# Altium project DM3370.PrjPcb (part 11 of 14)

## Sheet DM3370_USB.SchDoc: =project_title
size Tabloid; PageSetup: Record=PageOptions|CenterHorizontal=True|CenterVertical=True|PrintScale=0.73|XCorrection=1.00|YCorrection=1.00|PrintKind=0|BorderSize=5000000|LeftOffset=0|BottomOffset=0|Orientation=2|PaperLength=1000|PaperWidth=1000|Scale=100|PaperSource=7|PrintQuality=-4|MediaType=1|DitherType=10|PaperKind=A4|PrintScaleMode=1; CompanyName: Luxonis Holding; DrawnBy: David Malovrh; Organization: Luxonis Holding; Address1: 1925 Harmony Park Drive; Address2: Westminster, CO; Address3: 80234; Address4: United States; DocumentNumber: 7; Revision: R5M2E5; SheetNumber: 7; SheetTotal: 17
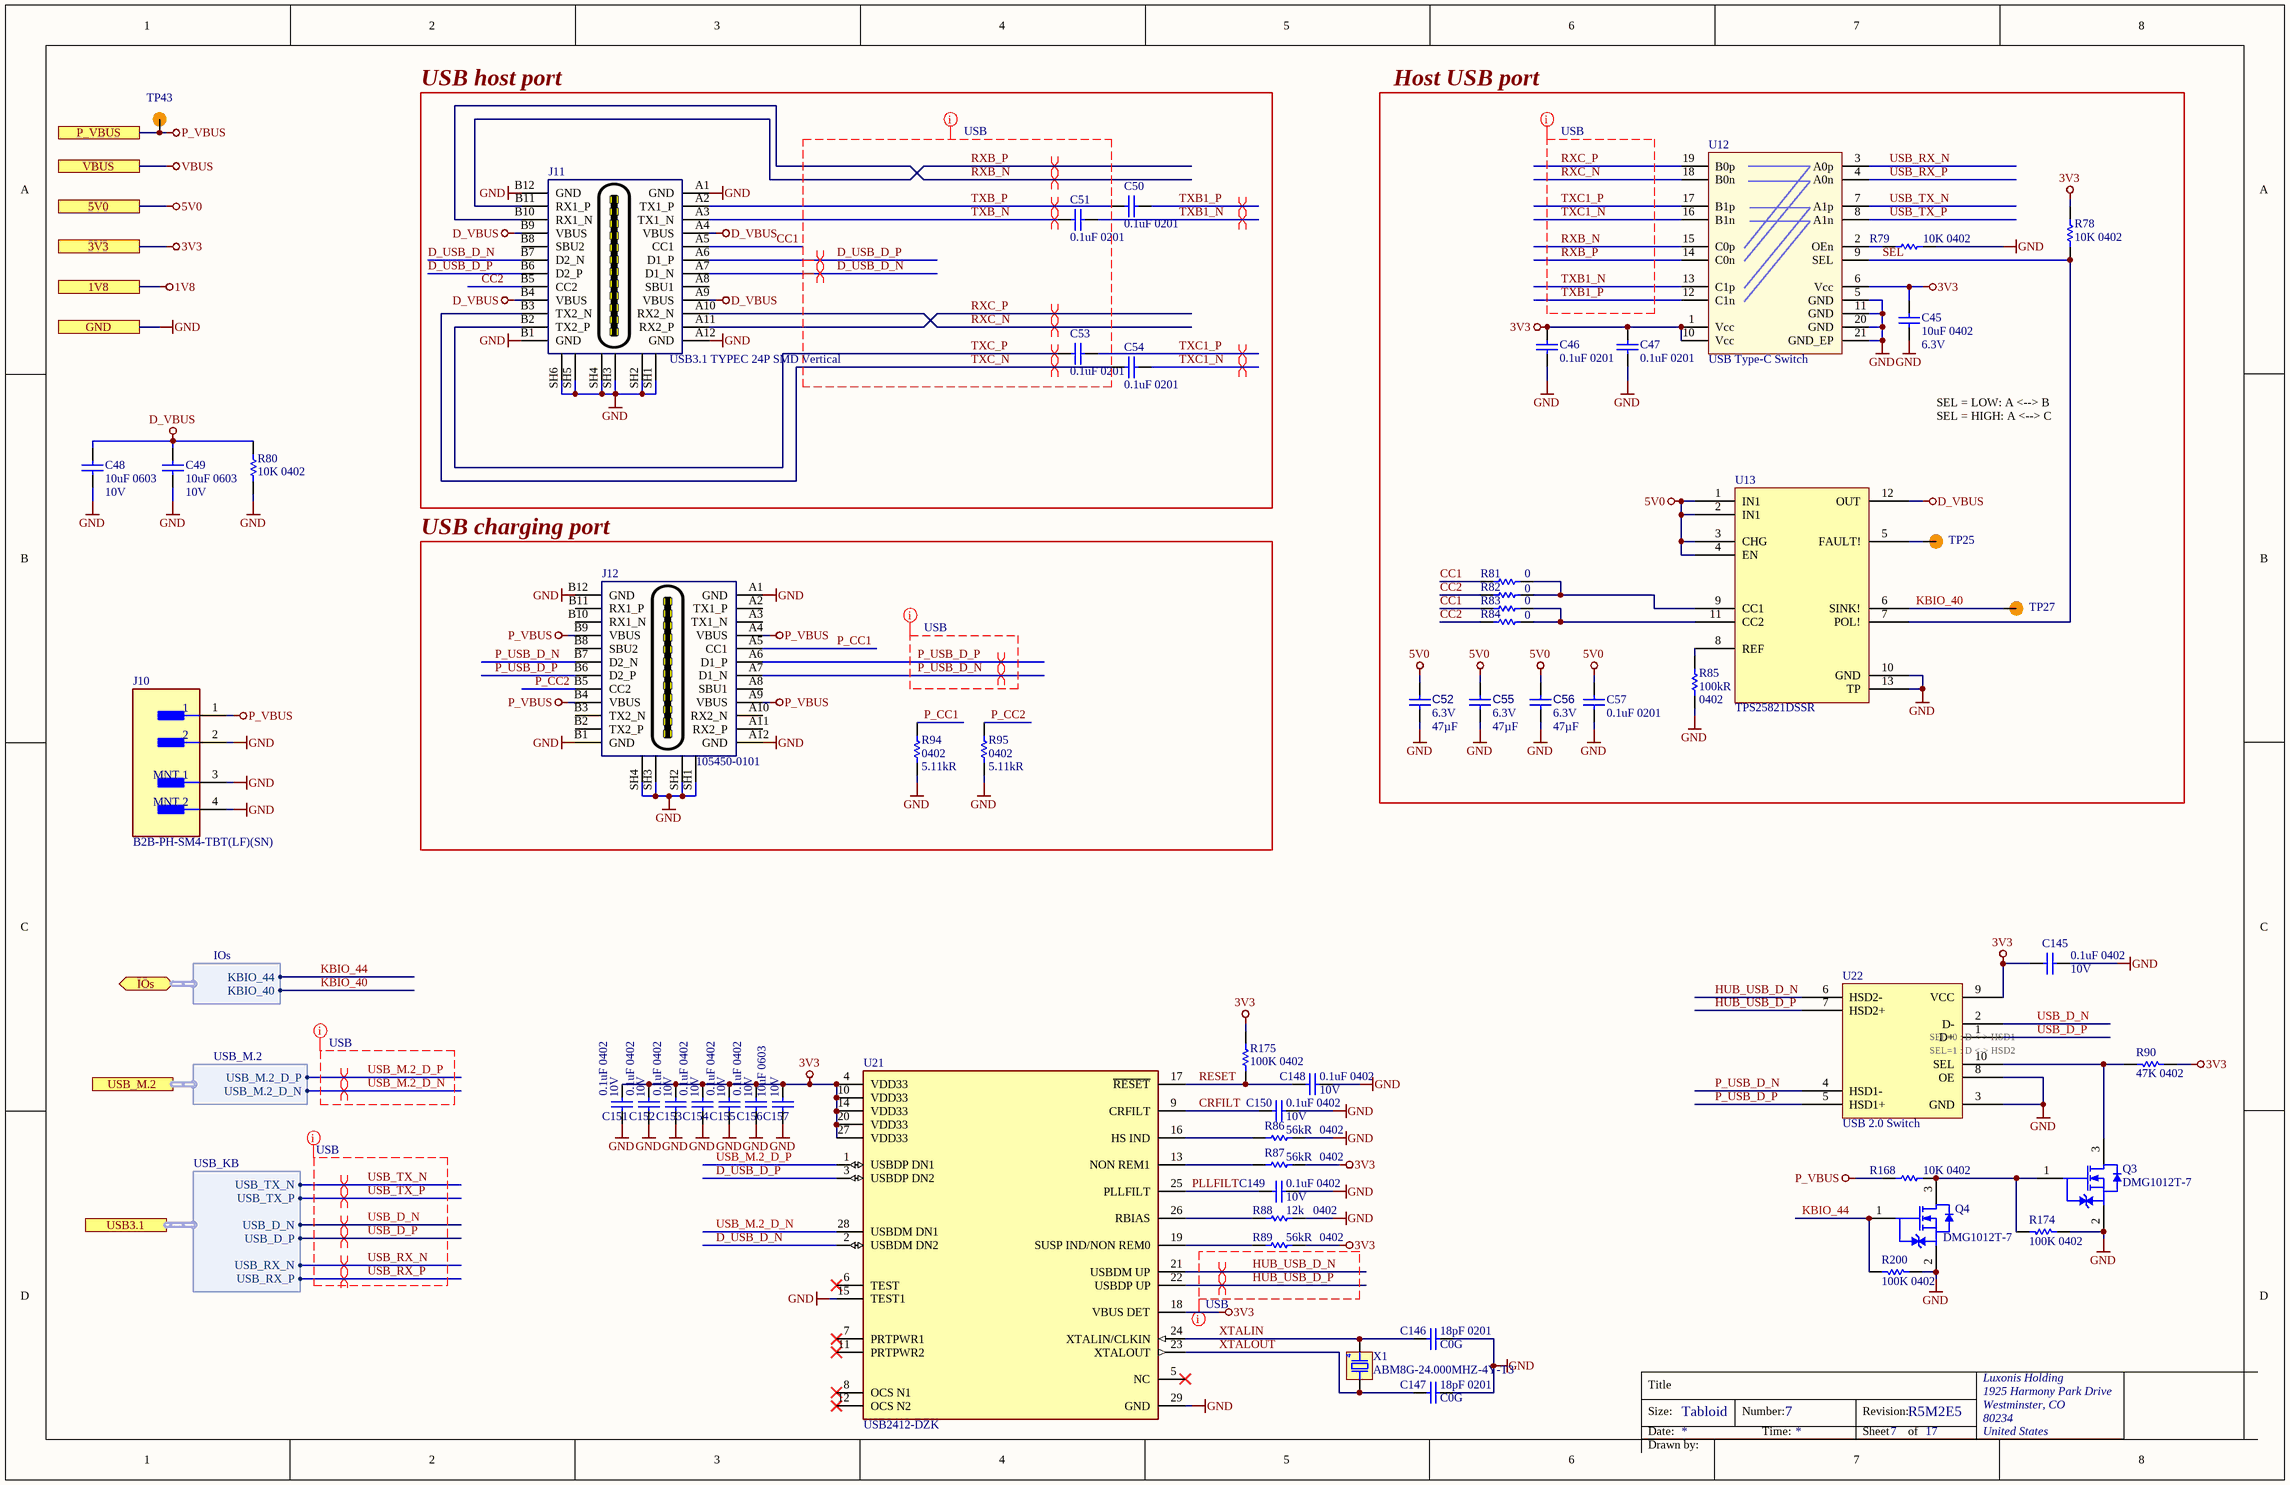
[diagram p14: DM3370_USB.SchDoc]

### Parts
C45  10uF 0402  Voltage Rating: 6.3V  [CAPC0402(1005)70_L]
C46  0.1uF 0201  [CAPC0201(0603)33_L]
C47  0.1uF 0201  [CAPC0201(0603)33_L]
C48  10uF 0603  Voltage Rating: 10V  [CAPC0603(1608)100_L]
C49  10uF 0603  Voltage Rating: 10V  [CAPC0603(1608)100_L]
C50  0.1uF 0201  [CAPC0201(0603)33_L]
C51  0.1uF 0201  [CAPC0201(0603)33_L]
C52  value 47µF  Voltage Rating: 6.3V  [CAPC0805(2012)145_L]  (hidden comment: C0805C476M9PACTU)
C53  0.1uF 0201  [CAPC0201(0603)33_L]
C54  0.1uF 0201  [CAPC0201(0603)33_L]
C55  value 47µF  Voltage Rating: 6.3V  [CAPC0805(2012)145_L]  (hidden comment: C0805C476M9PACTU)
C56  value 47µF  Voltage Rating: 6.3V  [CAPC0805(2012)145_L]  (hidden comment: C0805C476M9PACTU)
C57  0.1uF 0201  [CAPC0201(0603)33_L]
C145  0.1uF 0402  Voltage Rating: 10V  [CAPC0402(1005)70_L]
C146  18pF 0201  Dielectric: C0G  [CAPC0201(0603)33_L]
C147  18pF 0201  Dielectric: C0G  [CAPC0201(0603)33_L]
C148  0.1uF 0402  Voltage Rating: 10V  [CAPC0402(1005)70_L]
C149  0.1uF 0402  Voltage Rating: 10V  [CAPC0402(1005)70_L]
C150  0.1uF 0402  Voltage Rating: 10V  [CAPC0402(1005)70_L]
C151  0.1uF 0402  Voltage Rating: 10V  [CAPC0402(1005)70_L]
C152  0.1uF 0402  Voltage Rating: 10V  [CAPC0402(1005)70_L]
C153  0.1uF 0402  Voltage Rating: 10V  [CAPC0402(1005)70_L]
C154  0.1uF 0402  Voltage Rating: 10V  [CAPC0402(1005)70_L]
C155  0.1uF 0402  Voltage Rating: 10V  [CAPC0402(1005)70_L]
C156  0.1uF 0402  Voltage Rating: 10V  [CAPC0402(1005)70_L]
C157  10uF 0603  Voltage Rating: 10V  [CAPC0603(1608)100_L]
J10  B2B-PH-SM4-TBT(LF)(SN)  [FP-B2B-PH-SM4-TBT_LF_SN-MFG]
J11  USB3.1 TYPEC 24P SMD Vertical  [CX80B1-24P]
J12  105450-0101  [105450-0101]
Q3  DMG1012T-7  [DMG1012T-7]
Q4  DMG1012T-7  [DMG1012T-7]
R78  10K 0402  [RESC0402(1005)_L]
R79  10K 0402  [RESC0402(1005)_L]
R80  10K 0402  [RESC0402(1005)_L]
R81  value 0  [RESC0402(1005)_L]  (hidden comment: CRCW04020000Z0ED)
R82  value 0  [RESC0402(1005)_L]  (hidden comment: CRCW04020000Z0ED)
R83  value 0  [RESC0402(1005)_L]  (hidden comment: CRCW04020000Z0ED)
R84  value 0  [RESC0402(1005)_L]  (hidden comment: CRCW04020000Z0ED)
R85  Resistance: 100kR  Case/Package: 0402  [RESC0402(1005)_L]  (hidden comment: RC0402FR-07100KL)
R86  Case/Package: 0402  Resistance: 56kR  [RESC0402(1005)_L]  (hidden comment: RC0402FR-0756KL)
R87  Case/Package: 0402  Resistance: 56kR  [RESC0402(1005)_L]  (hidden comment: RC0402FR-0756KL)
R88  value 12k  Case Code (Imperial): 0402  [RESC0402(1005)_L]  (hidden comment: RC0402FR-0712KL)
R89  Case/Package: 0402  Resistance: 56kR  [RESC0402(1005)_L]  (hidden comment: RC0402FR-0756KL)
R90  47K 0402  [RESC0402(1005)_L]
R94  Case Code (Imperial): 0402  Resistance: 5.11kR  [RESC0402(1005)_L]  (hidden comment: RC0402FR-075K11L)
R95  Case Code (Imperial): 0402  Resistance: 5.11kR  [RESC0402(1005)_L]  (hidden comment: RC0402FR-075K11L)
R168  10K 0402  [RESC0402(1005)_L]
R174  100K 0402  [RESC0402(1005)_L]
R175  100K 0402  [RESC0402(1005)_L]
R200  100K 0402  [RESC0402(1005)_L]
TP25  TEST_POINT  [TP100_200_NS]  (value not drawn)  (no BOM)
TP27  TEST_POINT  [TP100_200_NS]  (value not drawn)  (no BOM)
TP43  TEST_POINT  [TP100_200_NS]  (value not drawn)  (no BOM)
U12  USB Type-C Switch  [CBTL02043A]
U13  TPS25821DSSR  [TPS25821]
U21  USB2412-DZK  [FP-USB2412-DZK-MFG]
U22  USB 2.0 Switch  [FSUSB42UMX]
X1  ABM8G-24.000MHZ-4Y-T3  [MCSJK-7U-24.00-12-30-60-B-30]

### Blocks framed on the sheet
USB host port: C50 C51 C53 C54 J11
Host USB port: C45-C47 C52 C55-C57 R78 R79 R81-R85 TP25 TP27 U12 U13
USB charging port: J12 R94 R95

### Ports
1V8, 3V3, 5V0, GND, IOs (bidir, harness IOs), P_VBUS, USB3.1 (harness USB_KB), USB_M.2 (harness USB_M.2), VBUS

### Harnesses
USB_KB: USB_D_P, USB_D_N, USB_TX_N, USB_TX_P, USB_RX_N, USB_RX_P
USB_M.2: USB_M.2_D_P, USB_M.2_D_N
IOs: KBIO_44, KBIO_40

### Nets
3V3: C45.2 C46.2 C47.2 C145.1 C151.2 C152.2 C153.2 C154.2 C155.2 C156.2 C157.2 R78.2 R87.2 R89.2 R90.1 R175.2 U12.1(Vcc) U12.6(Vcc) U12.10(Vcc) U21.4(VDD33) U21.10(VDD33) U21.14(VDD33) U21.18(VBUS_DET) U21.20(VDD33) U21.27(VDD33) U22.9(VCC) ; port 3V3
5V0: C52.2 C55.2 C56.2 C57.2 U13.1(IN1) U13.2(IN1) U13.3(CHG) U13.4(EN) ; port 5V0
D_VBUS: C48.2 C49.2 J11.A4(VBUS) J11.A9(VBUS) J11.B4(VBUS) J11.B9(VBUS) R80.2 U13.12(OUT)
GND: C45.1 C46.1 C47.1 C48.1 C49.1 C52.1 C55.1 C56.1 C57.1 C145.2 C146.2 C147.2 C148.1 C149.1 C150.1 C151.1 C152.1 C153.1 C154.1 C155.1 C156.1 C157.1 J10.2 J10.3(MNT_1) J10.4(MNT_2) J11.A1(GND) J11.A12(GND) J11.B1(GND) J11.B12(GND) J11.SH1(SH) J11.SH2(SH) J11.SH3(SH) J11.SH4(SH) J11.SH5(SH) J11.SH6(SH) J12.A1(GND) J12.A12(GND) J12.B1(GND) J12.B12(GND) J12.SH1(SH) J12.SH2(SH) J12.SH3(SH) J12.SH4(SH) Q3.2 Q4.2 R79.2 R80.1 R85.1 R86.2 R88.2 R94.1 R95.1 R174.1 R200.1 U12.5(GND) U12.11(GND) U12.20(GND) U12.21(GND_EP) U13.10(GND) U13.13(TP) U21.15(TEST1) U21.29(GND) U22.3(GND) U22.8(OE) ; port GND
P_VBUS: J10.1 J12.A4(VBUS) J12.A9(VBUS) J12.B4(VBUS) J12.B9(VBUS) R168.1 TP43.1 ; port P_VBUS
VBUS: port VBUS
CC1: J11.A5(CC1) R81.1 R83.1
CC2: J11.B5(CC2) R82.1 R84.1
CRFILT: C150.2 U21.9(CRFILT)
D_USB_D_N: J11.A7(D1_N) J11.B7(D2_N) U21.2(USBDM_DN2)
D_USB_D_P: J11.A6(D1_P) J11.B6(D2_P) U21.3(USBDP_DN2)
HUB_USB_D_N: U21.21(USBDM_UP) U22.6(HSD2-)
HUB_USB_D_P: U21.22(USBDP_UP) U22.7(HSD2+)
KBIO_40: TP27.1 U13.6(SINK!) ; port IOs.KBIO_40
KBIO_44: Q4.1 R200.2 ; port IOs.KBIO_44
P_CC1: J12.A5(CC1) R94.2
P_CC2: J12.B5(CC2) R95.2
P_USB_D_N: J12.A7(D1_N) J12.B7(D2_N) U22.4(HSD1-)
P_USB_D_P: J12.A6(D1_P) J12.B6(D2_P) U22.5(HSD1+)
PLLFILT: C149.2 U21.25(PLLFILT)
RESET: C148.2 R175.1 U21.17(~{RESET})
RXB_N: J11.B10(RX1_N) U12.15(C0p)
RXB_P: J11.B11(RX1_P) U12.14(C0n)
RXC_N: J11.A10(RX2_N) U12.18(B0n)
RXC_P: J11.A11(RX2_P) U12.19(B0p)
SEL: R78.1 U12.9(SEL) U13.7(POL!)
TXB1_N: C51.2 U12.13(C1p)
TXB1_P: C50.2 U12.12(C1n)
TXB_N: C51.1 J11.A3(TX1_N)
TXB_P: C50.1 J11.A2(TX1_P)
TXC1_N: C54.2 U12.16(B1n)
TXC1_P: C53.2 U12.17(B1p)
TXC_N: C54.1 J11.B3(TX2_N)
TXC_P: C53.1 J11.B2(TX2_P)
USB_D_N: U22.2(D-) ; port USB3.1.USB_D_N
USB_D_P: U22.1(D+) ; port USB3.1.USB_D_P
USB_M.2_D_N: U21.28(USBDM_DN1) ; port USB_M.2.USB_M.2_D_N
USB_M.2_D_P: U21.1(USBDP_DN1) ; port USB_M.2.USB_M.2_D_P
USB_RX_N: U12.3(A0p) ; port USB3.1.USB_RX_N
USB_RX_P: U12.4(A0n) ; port USB3.1.USB_RX_P
USB_TX_N: U12.7(A1p) ; port USB3.1.USB_TX_N
USB_TX_P: U12.8(A1n) ; port USB3.1.USB_TX_P
XTALIN: C146.1 U21.24(XTALIN/CLKIN) X1.3(OSC2)
XTALOUT: C147.1 U21.23(XTALOUT) X1.1(OSC1)
NetQ3_1: Q3.1 Q4.3 R168.2 R174.2
NetQ3_3: Q3.3 R90.2 U22.10(SEL)
NetR79_1: R79.1 U12.2(OEn)
NetR81_2: R81.2 R82.2 U13.9(CC1)
NetR83_2: R83.2 R84.2 U13.11(CC2)
NetR85_2: R85.2 U13.8(REF)
NetR86_1: R86.1 U21.16(HS_IND)
NetR87_1: R87.1 U21.13(NON_REM1)
NetR88_1: R88.1 U21.26(RBIAS)
NetR89_1: R89.1 U21.19(SUSP_IND/NON_REM0)
NetTP25_1: TP25.1 U13.5(FAULT!)

Not connected (* = marked no-connect by the designer): J11 A8(SBU1) B8(SBU2); J12 A2(TX1_P) A3(TX1_N) A8(SBU1) A10(RX2_N) A11(RX2_P) B2(TX2_P) B3(TX2_N) B8(SBU2) B10(RX1_N) B11(RX1_P); U21 5(NC)* 6(TEST)* 7(PRTPWR1)* 8(OCS_N1)* 11(PRTPWR2)* 12(OCS_N2)*; X1 2(GND) 4(GND)

### Layout directives
differential pair; differential pair class 90ohm: D_USB_D_N, D_USB_D_P, HUB_USB_D_N, HUB_USB_D_P, P_USB_D_N, P_USB_D_P, RXB_N, RXB_P, RXC_N, RXC_P, TXB1_N, TXB1_P, TXB_N, TXB_P, TXC1_N, TXC1_P, TXC_N, TXC_P, USB_D_N, USB_D_P, USB_M.2_D_N, USB_M.2_D_P, USB_RX_N, USB_RX_P, USB_TX_N, USB_TX_P
net class USB: D_USB_D_N, D_USB_D_P, HUB_USB_D_N, HUB_USB_D_P, P_USB_D_N, P_USB_D_P, RXB_N, RXB_P, RXC_N, RXC_P, TXB1_N, TXB1_P, TXB_N, TXB_P, TXC1_N, TXC1_P, TXC_N, TXC_P, USB_D_N, USB_D_P, USB_M.2_D_N, USB_M.2_D_P, USB_RX_N, USB_RX_P, USB_TX_N, USB_TX_P

### Notes on the sheet
- SEL = LOW: A <--> B
  SEL = HIGH: A <--> C
- Title
- Size:
- Date:
- Tabloid
- Number:
- Time:
- Revision:
- Sheet
- of
- Drawn by:
- (in symbol FSUSB42UMX) SEL=0 : D <-> HSD1; SEL=1 : D <-> HSD2

### Library data of the parts
C45 = GRM155R60J106ME15D: CAP CER 10UF 6.3V X5R 0402 20%; Manufacturer 1: Murata; Supplier 1: Digi-Key; Manufacturer Part Number 1: GRM155R60J106ME15D; Stock 1: 1839627; Pricing 1: 1=0.23000, 10=0.15700, 100=0.07950, 500=0.05442, 1000=0.04814, 2500=0.04605, 5000=0.04186 (USD); RoHS: Yes; Mount: Surface Mount; Case/Package: 0402; Case Code (Metric): 1005; Case Code (Imperial): 0402; Min Operating Temperature: -55°C; Max Operating Temperature: 85°C; Packaging: Tape and Reel; Capacitance: 10uF; Dielectric: X5R; Length: 0.039inch; Width: 0.02inch; ComponentLink1URL: https://www.murata.com/~/media/webrenewal/support/library/catalog/products/capacitor/mlcc/c02e.ashx?la=en-us&src-supplier=Digi-Key; ComponentLink1Description: https://www.murata.com/~/media/webrenewal/support/library/catalog/products/capacitor/mlcc/c02e.ashx?la=en-us&src-supplier=Digi-Key; Supplier Part Number 1: 490-13238-1-ND; Voltage Rating (DC): 6.3V; Thickness: 0.026inch; Tolerance: 20%
C46 C47 C50 C51 C53 C54 C57 = GRM033R61A104KE15D: CAP CER 0.1UF 10V X5R 0201; Manufacturer 1: Murata; Capacitance: 100nF; Tolerance: 10%; Supplier 1: Digi-Key; Manufacturer Part Number 1: GRM033R61A104KE15D; Stock 1: 45335312; Pricing 1: 1=0.10000, 10=0.04200, 100=0.01860, 500=0.01330, 1000=0.01045, 2500=0.00950, 5000=0.00874 (USD); RoHS: Yes; Mount: Surface Mount; Case/Package: 0201; Weight: 6E-06oz; Case Code (Metric): 0603; Case Code (Imperial): 0201; Min Operating Temperature: -55°C; Max Operating Temperature: 85°C; Packaging: Tape and Reel; Voltage Rating: 10V; Package Quantity: 1; Voltage Rating (DC): 10V; Dielectric: X5R; Termination: SMD/SMT; Length: 0.6mm; Height: 0.3mm; Width: 0.012inch; Thickness: 0.013inch; Depth: 0.3mm; Radiation Hardening: No; Lead Free: Lead Free; REACH SVHC: No SVHC; ComponentLink1URL: https://datasheet.ciiva.com/26843/getdatasheetpartid-308656-26843739.pdf?src-supplier=Verical; ComponentLink1Description: https://datasheet.ciiva.com/26843/getdatasheetpartid-308656-26843739.pdf?src-supplier=Verical; ComponentLink2URL: https://datasheet.ciiva.com/5413/product-5413117.pdf?src-supplier=Mouser; ComponentLink2Description: https://datasheet.ciiva.com/5413/product-5413117.pdf?src-supplier=Mouser; ComponentLink3URL: https://datasheet.ciiva.com/6256/partnumbering-e-01-6256406.pdf?src-supplier=Digi-Key; ComponentLink3Description: https://datasheet.ciiva.com/6256/partnumbering-e-01-6256406.pdf?src-supplier=Digi-Key; ComponentLink4URL: https://datasheet.ciiva.com/6256/partnumbering-e-01-6256407.pdf?src-supplier=Digi-Key; ComponentLink4Description: https://datasheet.ciiva.com/6256/partnumbering-e-01-6256407.pdf?src-supplier=Digi-Key; ComponentLink5URL: https://datasheet.ciiva.com/6256/partnumbering-e-01-6256408.pdf?src-supplier=Digi-Key; ComponentLink5Description: https://datasheet.ciiva.com/6256/partnumbering-e-01-6256408.pdf?src-supplier=Digi-Key; Supplier Part Number 1: 490-5881-1-ND; Voltage: 10V
C48 C49 C157 = GRM188R61A106ME69D: as C25 on sheet DM3370_Power; Supplier 1: Digi-Key; Manufacturer Part Number 1: GRM188R61A106ME69D; Stock 1: 2873098; Pricing 1: 1=0.21000, 10=0.14100, 100=0.07130, 500=0.04876, 1000=0.04313 (USD); RoHS: Yes; Mount: Surface Mount; Case/Package: 0603; Weight: 0.000222oz; Case Code (Metric): 1608; Case Code (Imperial): 0603; Min Operating Temperature: -55°C; Max Operating Temperature: 85°C; Packaging: Tape and Reel; Tolerance: 20%; Capacitance: 10uF; Dielectric: X5R; Voltage Rating (DC): 10V; Package Quantity: 4000; Termination: SMD/SMT; Length: 1.6mm; Height: 0.8mm; Width: 0.8mm; Thickness: 0.035inch; Depth: 0.8mm; REACH SVHC: Unknown; Lead Free: Lead Free; ComponentLink1URL: http://www.mouser.com/ds/2/281/c02e-2905.pdf?src-supplier=Mouser; ComponentLink1Description: http://www.mouser.com/ds/2/281/c02e-2905.pdf?src-supplier=Mouser; ComponentLink2URL: http://components.arrow.com/part/dataview/0323_06119472?src-supplier=Arrow+Europe; ComponentLink2Description: http://components.arrow.com/part/dataview/0323_06119472?src-supplier=Arrow+Europe; ComponentLink3URL: http://www.farnell.com/datasheets/2048014.pdf?src-supplier=Farnell; ComponentLink3Description: http://www.farnell.com/datasheets/2048014.pdf?src-supplier=Farnell; ComponentLink4URL: http://www.farnell.com/datasheets/1872210.pdf?src-supplier=Farnell; ComponentLink4Description: http://www.farnell.com/datasheets/1872210.pdf?src-supplier=Farnell; ComponentLink5URL: http://search.murata.co.jp/Ceramy/image/img/A01X/G101/ENG/GRM188R61A106ME69-01.pdf?src-supplier=Digi-Key; ComponentLink5Description: http://search.murata.co.jp/Ceramy/image/img/A01X/G101/ENG/GRM188R61A106ME69-01.pdf?src-supplier=Digi-Key; ComponentLink6URL: http://www.farnell.com/datasheets/1872210.pdf?src-supplier=Newark; ComponentLink6Description: http://www.farnell.com/datasheets/1872210.pdf?src-supplier=Newark; ComponentLink7URL: http://www.farnell.com/datasheets/2048014.pdf?src-supplier=Element14; ComponentLink7Description: http://www.farnell.com/datasheets/2048014.pdf?src-supplier=Element14; ComponentLink8URL: http://www.farnell.com/datasheets/2048014.pdf?src-supplier=Newark; ComponentLink8Description: http://www.farnell.com/datasheets/2048014.pdf?src-supplier=Newark; Supplier Part Number 1: 490-10475-1-ND
C52 C55 C56 = CMP-001-00082-12: CAP CER 47UF 6.3V X5R 0805 10%; Manufacturer 1: KEMET; Capacitor Type: Ceramic; Tolerance: 10%; Mounting Technology: SMT; Case/Package: 0805; Max Operating Temperature: 85°C; Min Operating Temperature: -55°C; Dielectric: X5R; Manufacturer Part Number 1: C0805C476M9PACTU
C145 C148-C156 = GRM155R71A104JA01D: as C23 on sheet DM3370_Power; Manufacturer Part Number 1: GRM155R71A104JA01D; Supplier 1: Digi-Key; Stock 1: 1346709; Pricing 1: 1=0.10000, 10=0.02500, 100=0.01130, 500=0.00806, 1000=0.00633, 2500=0.00575, 5000=0.00529 (USD); RoHS: Yes; Mount: Surface Mount; Case/Package: 0402; Case Code (Imperial): 0402; Case Code (Metric): 1005; Min Operating Temperature: -55°C; Max Operating Temperature: 125°C; Tolerance: 5%; Packaging: Tape and Reel; Voltage Rating (DC): 10V; Dielectric: X7R; Package Quantity: 10000; Termination: SMD/SMT; Length: 1mm; Height: 0.5mm; Width: 0.02inch; Thickness: 0.022inch; Depth: 0.5mm; Radiation Hardening: No; Lead Free: Lead Free; ComponentLink1URL: https://datasheet.ciiva.com/5411/product-5411135.pdf?src-supplier=Mouser; ComponentLink1Description: https://datasheet.ciiva.com/5411/product-5411135.pdf?src-supplier=Mouser; ComponentLink2URL: https://datasheet.ciiva.com/11618/c02e-11618821.pdf?src-supplier=Avnet; ComponentLink2Description: https://datasheet.ciiva.com/11618/c02e-11618821.pdf?src-supplier=Avnet; Supplier Part Number 1: 490-10777-1-ND
C146 C147 = GRM0335C1E180FA01D: Cap Ceramic 18pF 25V C0G 1% Pad SMD 0201 125C T/R; Manufacturer 1: Murata; Supplier 1: Digi-Key; Manufacturer Part Number 1: GRM0335C1E180FA01D; RoHS: Yes; Category: Ceramic Capacitors; Stock 1: 27511; Pricing 1: 1=0.10000, 10=0.02100, 100=0.00930, 500=0.00666, 1000=0.00523, 2500=0.00476, 5000=0.00438 (USD); Mount: Surface Mount; Case/Package: 0201; Case Code (Imperial): 0201; Case Code (Metric): 0603; Min Operating Temperature: -55°C; Max Operating Temperature: 125°C; Capacitance: 18pF; Tolerance: 1%; Packaging: Tape and Reel; Voltage Rating (DC): 25V; Package Quantity: 15000; Voltage Rating: 25V; Termination: SMD/SMT; Length: 0.024inch; Height: 0.3mm; Thickness: 0.013inch; Width: 0.3mm; ComponentLink1URL: https://datasheet.ciiva.com/29538/partnumbering-e-01-29538328.pdf?src-supplier=Digi-Key; ComponentLink1Description: https://datasheet.ciiva.com/29538/partnumbering-e-01-29538328.pdf?src-supplier=Digi-Key; Supplier 2: Digi-Key; Supplier 3: Mouser; Supplier Part Number 3: 81-GRM0335C1E180FA1D; Supplier Part Number 2: 490-17804-2-ND; Supplier Part Number 1: 490-17804-1-ND
J10 = CMP-002-00127-2: Connector Header, PH Series, 2 Position, 2.00mm, 100V, Surface Mount, Solder, Pick and Place, Natural.; Manufacturer 1: JST; Manufacturer Part Number 1: B2B-PH-SM4-TB
J11 = CX80B1-24P: CONN RCPT USB3.1 TYPEC 24POS SMD Vertical; Manufacturer 1: Hirose Electric Co Ltd; Connector Type: USB; Number of Contacts: 24; Gender: Receptacle; Number of Ports: 1; Current Rating: 1.25A; Mating Cycles: 10000; Pitch: 0.5mm; Shielding: Shielded; Supplier 1: Digi-Key; Case/Package: 0101; Number of Pins: 24; Contact Material: Copper Alloy; Contact Plating: Gold; Number of Terminals: 24; Housing Material: Thermoplastic; Insulation Color: Black; Min Operating Temperature: -30°C; Max Operating Temperature: 80°C; Packaging: Tape and Reel; Orientation: Vertical; Termination: Solder; USB Standard: USB 3.1; Features: Shielded; Length: 8.94mm; REACH SVHC: Unknown; Flammability Rating: UL94 V-0; Supplier Part Number 1: 26-CX80B1-24PCT-ND; Mount: Surface Mount,Through Hole,Vertical; RoHS: Yes; Pricing 1: 1=2.15000, 10=1.94900, 25=1.82960, 50=1.75000, 100=1.67050, 250=1.51140, 500=1.39208 (USD); Stock 1: 939; Manufacturer Part Number 1: CX80B1-24P; ComponentLink1Description: Product page; ComponentLink1URL: https://www.jae.com/en/connectors/series/detail/product/id=66513; ComponentLink2Description: Digikey; ComponentLink2URL: https://www.digikey.com/en/products/detail/jae-electronics/DX07S024WJ3R400/6594044
J12 = CMP-005-000009-1: CONN RCP USB3.1 TYPEC 24P SMD RA; Manufacturer 1: Molex; Mating Cycles: 10000; Gender: Receptacle; Pitch: 0.5mm; Shielding: Shielded; Current Rating: 5A; Number of Contacts: 24; Connector Type: USB; Number of Ports: 1; ComponentLink3URL: http://www.farnell.com/datasheets/2672741.pdf?src-supplier=Newark; REACH SVHC: Unknown; Contact Material: Copper Alloy; Design Item ID: 105450-0101; ComponentLink4Description: https://www.molex.com/pdm_docs/sd/1054500101_sd.pdf?src-supplier=Digi-Key; Features: Shielded; Housing Material: Thermoplastic; Mount: Surface Mount,Through Hole,Horizontal; ComponentLink5URL: https://www.molex.com/pdm_docs/ps/PS-105448-001.pdf?src-supplier=Digi-Key; ComponentLink7Description: http://www.literature.molex.com/SQLImages/kelmscott/Molex/PDF_Images/987651-4081.PDF?src-supplier=Avnet; Insulation Color: Black; ComponentLink5Description: https://www.molex.com/pdm_docs/ps/PS-105448-001.pdf?src-supplier=Digi-Key; ComponentLink2Description: http://www.farnell.com/datasheets/2801634.pdf?src-supplier=Farnell; Manufacturer Part Number 1: 105450-0101; USB Standard: USB 3.1; Length: 8.94mm; Case/Package: 0101; ComponentLink8URL: http://www.literature.molex.com/SQLImages/kelmscott/Molex/PDF_Images/987651-4081.PDF?src-supplier=Avnet+Asia; ComponentLink6Description: http://www.farnell.com/datasheets/2015275.pdf?src-supplier=Element14; Number of Pins: 24; Stock 1: 13882; Packaging: Tape and Reel; Contact Plating: Gold; Termination: Solder; ComponentLink1Description: http://www.farnell.com/datasheets/2673427.pdf?src-supplier=Farnell; ComponentLink4URL: https://www.molex.com/pdm_docs/sd/1054500101_sd.pdf?src-supplier=Digi-Key; Orientation: Right Angle; Min Operating Temperature: -30°C; ComponentLink6URL: http://www.farnell.com/datasheets/2015275.pdf?src-supplier=Element14; ComponentLink1URL: http://www.farnell.com/datasheets/2673427.pdf?src-supplier=Farnell; ComponentLink8Description: http://www.literature.molex.com/SQLImages/kelmscott/Molex/PDF_Images/987651-4081.PDF?src-supplier=Avnet+Asia; Flammability Rating: UL94 V-0; ComponentLink7URL: http://www.literature.molex.com/SQLImages/kelmscott/Molex/PDF_Images/987651-4081.PDF?src-supplier=Avnet; Max Operating Temperature: 85°C; ComponentLink2URL: http://www.farnell.com/datasheets/2801634.pdf?src-supplier=Farnell; ComponentLink3Description: http://www.farnell.com/datasheets/2672741.pdf?src-supplier=Newark; Source: LuxonisMaster.SchLib; RoHS: Yes; Pricing 1: 1=2.15000, 10=1.94900, 25=1.82960, 50=1.75000, 100=1.67050, 250=1.51140, 500=1.39208 (USD); Number of Terminals: 24
Q3 Q4 = DMG1012T-7: MOSFET N-CH 20V 630MA SOT-523; Manufacturer 1: Diodes; Rds On Max: 400mR; Input Capacitance: 60.67pF; Max Power Dissipation: 280mW; Rise Time: 7.4ns; Fall Time: 12.3ns; Turn-On Delay Time: 5.1ns; Turn-Off Delay Time: 26.7ns; Gate to Source Voltage (Vgs): 6V; Number of Elements: 1; Drain to Source Resistance: 300mR; Element Configuration: Single; Threshold Voltage: 1V; FET Type: 1 N-Channel; Manufacturer Part Number 1: DMG1012T-7; Supplier 1: Digi-Key; Stock 1: 1268946; Pricing 1: 1=0.30000, 10=0.24600, 100=0.10070, 500=0.08396, 1000=0.05834 (USD); RoHS: Yes; Mount: Surface Mount; Case/Package: SOT-523; Number of Pins: 3; Weight: 7.1E-05oz; Contact Plating: Tin,Matte; Min Operating Temperature: -55°C; Max Operating Temperature: 150°C; Continuous Drain Current (ID): 630mA; Packaging: Tape and Reel; Drain to Source Voltage (Vdss): 20V; Package Quantity: 3000; Drain to Source Breakdown Voltage: 20V; Power Dissipation: 280mW; Number of Channels: 1; On-State Resistance: 400MR; Length: 1.7mm; Height: 0.8mm; Width: 0.85mm; Radiation Hardening: No; REACH SVHC: No SVHC; Lead Free: Lead Free; ComponentLink1URL: https://datasheet.ciiva.com/934/ds31783-934512.pdf?src-supplier=Digi-Key; ComponentLink1Description: https://datasheet.ciiva.com/934/ds31783-934512.pdf?src-supplier=Digi-Key; ComponentLink2URL: https://datasheet.ciiva.com/4442/ds31783-44973-4442944.pdf?src-supplier=Mouser; ComponentLink2Description: https://datasheet.ciiva.com/4442/ds31783-44973-4442944.pdf?src-supplier=Mouser; ComponentLink3URL: https://datasheet.ciiva.com/11174/ds31783-11174965.pdf?src-supplier=Avnet; ComponentLink3Description: https://datasheet.ciiva.com/11174/ds31783-11174965.pdf?src-supplier=Avnet; ComponentLink4URL: https://datasheet.ciiva.com/17324/ds31783-17324010.pdf?src-supplier=Avnet+Europe; ComponentLink4Description: https://datasheet.ciiva.com/17324/ds31783-17324010.pdf?src-supplier=Avnet+Europe; ComponentLink5URL: https://datasheet.ciiva.com/6383/ds31783-6383803.pdf?src-supplier=Digi-Key; ComponentLink5Description: https://datasheet.ciiva.com/6383/ds31783-6383803.pdf?src-supplier=Digi-Key; ComponentLink6URL: https://datasheet.ciiva.com/934/ds31783-934511.pdf?src-supplier=Digi-Key; ComponentLink6Description: https://datasheet.ciiva.com/934/ds31783-934511.pdf?src-supplier=Digi-Key; Supplier Part Number 1: DMG1012T-7DICT-ND; Supplier 2: Mouser; Supplier Part Number 2: 621-DMG1012T-7
R78-R80 R168 = RC0402FR-1310KL: as R64 on sheet DM3370_Power; ComponentLink1URL: https://datasheet.ciiva.com/16940/pyu-rc0402-51-rohs-l-6-16940293.pdf?src-supplier=Avnet+Europe; ComponentLink1Description: https://datasheet.ciiva.com/16940/pyu-rc0402-51-rohs-l-6-16940293.pdf?src-supplier=Avnet+Europe; ComponentLink2URL: https://datasheet.ciiva.com/28386/pyu-rc0402-51-rohs-l-6-28386855.pdf?src-supplier=Avnet+Europe; ComponentLink2Description: https://datasheet.ciiva.com/28386/pyu-rc0402-51-rohs-l-6-28386855.pdf?src-supplier=Avnet+Europe; ComponentLink3URL: https://datasheet.ciiva.com/16740/pyu-rc0402-51-rohs-l-6-r-16740602.pdf?src-supplier=Future+Electronics; ComponentLink3Description: https://datasheet.ciiva.com/16740/pyu-rc0402-51-rohs-l-6-r-16740602.pdf?src-supplier=Future+Electronics; ComponentLink4URL: https://datasheet.ciiva.com/8891/pyu-rc0402-51-rohs-l-6-8891339.pdf?src-supplier=Avnet; ComponentLink4Description: https://datasheet.ciiva.com/8891/pyu-rc0402-51-rohs-l-6-8891339.pdf?src-supplier=Avnet; ComponentLink5URL: https://datasheet.ciiva.com/5557/pyu-rc0402-51-rohs-l-6-r-5557997.pdf?src-supplier=Mouser; ComponentLink5Description: https://datasheet.ciiva.com/5557/pyu-rc0402-51-rohs-l-6-r-5557997.pdf?src-supplier=Mouser; ComponentLink6URL: https://datasheet.ciiva.com/7983/1018594-7983533.pdf?src-supplier=Element14; ComponentLink6Description: https://datasheet.ciiva.com/7983/1018594-7983533.pdf?src-supplier=Element14; Supplier 1: Newark; Manufacturer Part Number 1: RC0402FR-1310KL; Stock 1: 62239; Pricing 1: 1=0.10000, 25=0.01200, 100=0.00400, 250=0.00400, 500=0.00300, 1000=0.00300 (USD); RoHS: Yes; Case/Package: 0402; Number of Pins: 2; Contact Plating: Tin,Matte,Lead; Case Code (Imperial): 0402; Case Code (Metric): 1005; Min Operating Temperature: -55°C; Max Operating Temperature: 155°C; Tolerance: 1%; Composition: Thick Film; Packaging: Tape and Reel; Termination: SMD/SMT; Military Standard: Not; Voltage Rating (DC): 50V; Working Voltage: 50V; Number of Terminations: 2; Length: 1mm; Depth: 0.5mm; Radiation Hardening: No; REACH SVHC: No SVHC; Lead Free: Lead Free; Supplier Part Number 1: 67R9960
R81-R84 = CMP-013-000022-3: RES SMD 0 OHM JUMPER 1/16W 0402; Manufacturer 1: Vishay; Max Power Dissipation: 63mW; Voltage Rating: 50V; Resistance: 0mR; Tolerance: 5%; Design Item ID: CRCW04020000Z0ED; Min Operating Temperature: -55°C; Case Code (Imperial): 0402; Manufacturer Part Number 1: CRCW04020000Z0ED; Case Code (Metric): 1005; Power Rating: 63mW; Length: 1mm; Max Operating Temperature: 155°C; Height: 0.35mm; Case/Package: 0402; Depth: 0.5mm
R85 = CMP-013-000035-2: RES SMD 100K OHM 1% 1/16W 0402; Manufacturer 1: Yageo; Voltage Rating: 50V; Power Rating: 63mW; Length: 0.039inch; Height: 0.016inch; Manufacturer Part Number 1: RC0402FR-07100KL; Tolerance: 1%; Design Item ID: RC0402FR-07100KL; Max Power Dissipation: 63mW; Case Code (Metric): 1005; Max Operating Temperature: 155°C; Min Operating Temperature: -55°C; Case Code (Imperial): 0402; Depth: 0.5mm
R86 R87 R89 = CMP-013-000017-2: RES SMD 56K OHM 1% 1/16W 0402 56 kOhms ±1% 0.063W, 1/16W Chip Resistor 0402 (1005 Metric) Moisture Resistant Thick Film; Manufacturer 1: Yageo; Voltage Rating: 50V; Power Rating: 62.5mW; Max Power Dissipation: 63mW; Manufacturer Part Number: RC0402FR-0756KL; Design Item ID: RC0402FR-0756KL; Tolerance: 1%; Manufacturer Part Number 1: RC0402FR-0756KL; Height: 0.016inch; Min Operating Temperature: -55°C; Max Operating Temperature: 155°C; Case Code (Imperial): 0402; Case Code (Metric): 1005; Length: 1mm; Manufacturer: Yageo; Depth: 0.5mm
R88 = CMP-013-000008-3: as R67 on sheet DM3370_Power; Manufacturer Part Number 1: RC0402FR-0712KL; Height: 0.016inch; Max Operating Temperature: 155°C; Length: 1mm; Design Item ID: RC0402FR-0712KL; Tolerance: 1%; Resistance: 12k; Case Code (Metric): 1005; Min Operating Temperature: -55°C; Case/Package: 0402; Depth: 0.5mm
R90 = RC0402FR-0747KL: RES SMD 47K OHM 1% 1/16W 0402; Manufacturer 1: Yageo; Resistance: 47kR; Power Rating: 62.5mW; Temperature Coefficient: 100ppm/°C; Voltage Rating: 50V; Max Power Dissipation: 63mW; Manufacturer Part Number 1: RC0402FR-0747KL; Supplier 1: Digi-Key; Stock 1: 8672261; Pricing 1: 1=0.10000, 10=0.01600, 100=0.00640, 1000=0.00289, 2500=0.00251, 5000=0.00207 (USD); RoHS: Yes; Case/Package: 0402; Case Code (Imperial): 0402; Case Code (Metric): 1005; Min Operating Temperature: -55°C; Max Operating Temperature: 155°C; Tolerance: 1%; Packaging: Tape and Reel; Composition: Thick Film; Termination: SMD/SMT; Package Quantity: 1; Number of Terminations: 2; Military Standard: Not; Features: Moisture Resistant; Length: 1mm; Height: 0.016inch; Width: 0.5mm; Depth: 0.5mm; Lead Free: Lead Free; REACH SVHC: Unknown; ComponentLink1URL: https://datasheet.ciiva.com/16793/pyu-rc0402-51-rohs-l-6-r-16793430.pdf?src-supplier=Future+Electronics; ComponentLink1Description: https://datasheet.ciiva.com/16793/pyu-rc0402-51-rohs-l-6-r-16793430.pdf?src-supplier=Future+Electronics; ComponentLink2URL: https://datasheet.ciiva.com/46412/1018594-46412839.pdf?src-supplier=Element14; ComponentLink2Description: https://datasheet.ciiva.com/46412/1018594-46412839.pdf?src-supplier=Element14; ComponentLink3URL: https://datasheet.ciiva.com/15189/getdatasheetpartid-323748-15189466.pdf?src-supplier=Verical; ComponentLink3Description: https://datasheet.ciiva.com/15189/getdatasheetpartid-323748-15189466.pdf?src-supplier=Verical; ComponentLink4URL: https://datasheet.ciiva.com/2453/pyu-r-int-thick-7-2453388.pdf?src-supplier=Digi-Key; ComponentLink4Description: https://datasheet.ciiva.com/2453/pyu-r-int-thick-7-2453388.pdf?src-supplier=Digi-Key; ComponentLink5URL: https://datasheet.ciiva.com/2453/pyu-r-int-thick-7-2453389.pdf?src-supplier=Digi-Key; ComponentLink5Description: https://datasheet.ciiva.com/2453/pyu-r-int-thick-7-2453389.pdf?src-supplier=Digi-Key; ComponentLink6URL: https://datasheet.ciiva.com/2453/pyu-r-int-thick-7-2453390.pdf?src-supplier=Digi-Key; ComponentLink6Description: https://datasheet.ciiva.com/2453/pyu-r-int-thick-7-2453390.pdf?src-supplier=Digi-Key; Supplier 2: Newark; Supplier Part Number 1: 311-47.0KLRCT-ND; Supplier Part Number 2: 26M6788
R94 R95 = CMP-013-000056-2: RES SMD 5.11K OHM 1% 1/16W 0402 5.11 kOhms ±1% 0.063W, 1/16W Chip Resistor 0402 (1005 Metric) Moisture Resistant Thick Film; Manufacturer 1: Yageo; Voltage Rating: 50V; Max Power Dissipation: 63mW; Power Rating: 62.5mW; Case Code (Metric): 1005; Case/Package: 0402; Length: 1mm; Height: 0.016inch; Max Operating Temperature: 155°C; Manufacturer Part Number 1: RC0402FR-075K11L; Tolerance: 1%; Depth: 0.5mm; Min Operating Temperature: -55°C; Design Item ID: RC0402FR-075K11L
R174 R175 R200 = RC0402FR-07100KL: as R57 on sheet DM3370_Power; Supplier 1: Digi-Key; Manufacturer Part Number 1: RC0402FR-07100KL; Stock 1: 50867324; Pricing 1: 1=0.10000, 10=0.01500, 100=0.00600, 1000=0.00270, 2500=0.00235, 5000=0.00194 (USD); RoHS: Yes; Case/Package: 0402; Case Code (Metric): 1005; Case Code (Imperial): 0402; Min Operating Temperature: -55°C; Max Operating Temperature: 155°C; Tolerance: 1%; Packaging: Tape and Reel; Composition: Thick Film; Termination: SMD/SMT; Military Standard: Not; Package Quantity: 1; Number of Terminations: 2; Max Power Dissipation: 63mW; Features: Moisture Resistant; Working Voltage: 50V; Length: 0.039inch; Height: 0.016inch; Width: 0.02inch; Depth: 0.5mm; Lead Free: Lead Free; REACH SVHC: No SVHC; ComponentLink1URL: https://datasheet.ciiva.com/11819/0900766b80c66297-11819452.pdf?src-supplier=RSComponents; ComponentLink1Description: https://datasheet.ciiva.com/11819/0900766b80c66297-11819452.pdf?src-supplier=RSComponents; ComponentLink2URL: https://datasheet.ciiva.com/2453/pyu-r-int-thick-7-2453361.pdf?src-supplier=Digi-Key; ComponentLink2Description: https://datasheet.ciiva.com/2453/pyu-r-int-thick-7-2453361.pdf?src-supplier=Digi-Key; ComponentLink3URL: https://datasheet.ciiva.com/2453/pyu-r-int-thick-7-2453362.pdf?src-supplier=Digi-Key; ComponentLink3Description: https://datasheet.ciiva.com/2453/pyu-r-int-thick-7-2453362.pdf?src-supplier=Digi-Key; ComponentLink4URL: https://datasheet.ciiva.com/2453/pyu-r-int-thick-7-2453363.pdf?src-supplier=Digi-Key; ComponentLink4Description: https://datasheet.ciiva.com/2453/pyu-r-int-thick-7-2453363.pdf?src-supplier=Digi-Key; ComponentLink5URL: https://datasheet.ciiva.com/22747/1018594-22747509.pdf?src-supplier=Element14; ComponentLink5Description: https://datasheet.ciiva.com/22747/1018594-22747509.pdf?src-supplier=Element14; ComponentLink6URL: https://datasheet.ciiva.com/15189/getdatasheetpartid-323696-15189334.pdf?src-supplier=Verical; ComponentLink6Description: https://datasheet.ciiva.com/15189/getdatasheetpartid-323696-15189334.pdf?src-supplier=Verical; ComponentLink7URL: https://datasheet.ciiva.com/12667/pyu-rc0402-51-rohs-l-6-r-12667930.pdf?src-supplier=Mouser; ComponentLink7Description: https://datasheet.ciiva.com/12667/pyu-rc0402-51-rohs-l-6-r-12667930.pdf?src-supplier=Mouser; Supplier 2: Newark; Supplier 3: Mouser; Supplier Part Number 1: 311-100KLRCT-ND; Supplier Part Number 2: 67R9887; Supplier Part Number 3: 603-RC0402FR-07100KL
TP25 TP27 TP43 = CMP-015-000000-1: Design Item ID: TEST_POINT; Source: LuxonisMaster.SchLib
U12 = CBTL02043A: Multiplexer And Demux/Decoder, CBT/FST/QS/5C/B Series, 1-Func, 2 Line Input, 1 Line Output, True Output, PQCC20; Manufacturer 1: NXP Semiconductors; Manufacturer Part Number 1: CBTL02043ABQ,115; Supplier 1: Digi-Key; RoHS: Yes; Category: Interface ICs; Stock 1: 19938; Pricing 1: 1=1,77000, 10=1,63000 (USD); ComponentLink1URL: https://datasheet.ciiva.com:443/pdfs/VipMasterIC/IC/PHGL/PHGL-S-A0000727649/PHGL-S-A0000727649-1.pdf?src-supplier=IHS+Markit; ComponentLink1Description: https://datasheet.ciiva.com:443/pdfs/VipMasterIC/IC/PHGL/PHGL-S-A0000727649/PHGL-S-A0000727649-1.pdf?src-supplier=IHS+Markit; ComponentLink2URL: https://datasheet.ciiva.com/4921/cbtl02043a-cbtl02043b-87520-4921245.pdf?src-supplier=Mouser; ComponentLink2Description: https://datasheet.ciiva.com/4921/cbtl02043a-cbtl02043b-87520-4921245.pdf?src-supplier=Mouser; ComponentLink3URL: https://datasheet.ciiva.com/6637/cbtl02043a-cbtl02043b-6637066.pdf?src-supplier=Digi-Key; ComponentLink3Description: https://datasheet.ciiva.com/6637/cbtl02043a-cbtl02043b-6637066.pdf?src-supplier=Digi-Key; Supplier Part Number 1: 568-6678-1-ND
U13 = CMP-015-00015-1: USB Type-C™ source controller and 1.5A power switch; Manufacturer 1: Texas Instrumets; Nominal Supply Voltage: 5V; Max Supply Voltage: 6V; Min Supply Voltage: 4.5V; Mounting Technology: SMD; Pins: 13; Min Operating Temperature: -40°C; RoHS Compliant: Yes; Manufacturer Part Number 1: TPS25821DSS; Max Operating Temperature: 125°C
U21 = CMP-015-00027-1: USB Bus Controller, CMOS; Manufacturer 1: Microchip; Manufacturer Part Number 1: USB2412-DZK
U22 = FSUSB42UMX: IC USB SWITCH DPDT 10UMLP; Manufacturer 1: ON Semiconductor / Fairchild; Min Supply Voltage: 3V; Max Supply Voltage: 4.3V; Nominal Supply Current: 1uA; Number of Inputs: 2; Number of Channels: 1; Data Rate: 480Mbps; Output Current: 100mA; Propagation Delay: 0.25ns; Bandwidth: 720MHz; Turn-Off Delay Time: 25ns; On-State Resistance: 6.5R; Turn-On Delay Time: 30ns; Supply Type: Single; Manufacturer Part Number 1: FSUSB42UMX; Supplier 1: Digi-Key; Stock 1: 31151; Pricing 1: 1=0.59000, 10=0.50200, 100=0.34810, 500=0.28120, 1000=0.20755 (USD); RoHS: Yes; Mount: Surface Mount; Number of Pins: 10; Weight: 18.08g; Min Operating Temperature: -40°C; Max Operating Temperature: 85°C; Package Quantity: 1; Number of Outputs: 2; Packaging: Tape and Reel; Operating Supply Voltage: 4.3V; Number of Ports: 2; Termination: SMD/SMT; Throw Configuration: DPDT; Length: 1.4mm; Height: 0.5mm; Width: 1.8mm; Radiation Hardening: No; REACH SVHC: No SVHC; Lead Free: Lead Free; ComponentLink1URL: https://datasheet.ciiva.com/15108/getdatasheetpartid-189033-15108996.pdf?src-supplier=Verical; ComponentLink1Description: https://datasheet.ciiva.com/15108/getdatasheetpartid-189033-15108996.pdf?src-supplier=Verical; ComponentLink2URL: https://datasheet.ciiva.com/1504/1815547-1504946.pdf?src-supplier=Element14; ComponentLink2Description: https://datasheet.ciiva.com/1504/1815547-1504946.pdf?src-supplier=Element14; ComponentLink3URL: https://datasheet.ciiva.com/26074/fsusb42-26074741.pdf?src-supplier=Avnet+Europe; ComponentLink3Description: https://datasheet.ciiva.com/26074/fsusb42-26074741.pdf?src-supplier=Avnet+Europe; ComponentLink4URL: https://datasheet.ciiva.com/1561/fsusb42-1561415.pdf?src-supplier=Farnell; ComponentLink4Description: https://datasheet.ciiva.com/1561/fsusb42-1561415.pdf?src-supplier=Farnell; ComponentLink5URL: https://datasheet.ciiva.com/3233/fsusb42-3233259.pdf?src-supplier=Avnet; ComponentLink5Description: https://datasheet.ciiva.com/3233/fsusb42-3233259.pdf?src-supplier=Avnet; ComponentLink6URL: https://datasheet.ciiva.com/6638/fsusb42-6638604.pdf?src-supplier=Digi-Key; ComponentLink6Description: https://datasheet.ciiva.com/6638/fsusb42-6638604.pdf?src-supplier=Digi-Key; ComponentLink7URL: https://datasheet.ciiva.com/6638/fsusb42-6638607.pdf?src-supplier=Digi-Key; ComponentLink7Description: https://datasheet.ciiva.com/6638/fsusb42-6638607.pdf?src-supplier=Digi-Key; Supplier 2: Mouser; Supplier Part Number 1: FSUSB42UMXCT-ND; Supplier Part Number 2: 512-FSUSB42UMX; Supplier 3: Arrow; Supplier 4: Farnell; Supplier Part Number 3: FSUSB42UMX; Supplier Part Number 4: 1495467
X1 = CMP-006-000005-1: CRYSTAL 24.0000MHZ 10PF SMD; Manufacturer 1: Abracon; RoHS: Yes; ComponentLink1URL: https://datasheet.ciiva.com/854/abm8g-854913.pdf?src-supplier=Digi-Key; Manufacturer Part Number 1: ABM8G-24.000MHZ-4Y-T3; ComponentLink2URL: https://datasheet.ciiva.com/854/abm8g-854911.pdf?src-supplier=Digi-Key; ComponentLink2Description: https://datasheet.ciiva.com/854/abm8g-854911.pdf?src-supplier=Digi-Key; Pricing 1: 1=0,67000, 10=0,59600, 50=0,55720, 100=0,49250, 500=0,46656, 1000=0,38880 (USD); ComponentLink1Description: https://datasheet.ciiva.com/854/abm8g-854913.pdf?src-supplier=Digi-Key; ComponentLink3URL: https://datasheet.ciiva.com/854/abm8g-854912.pdf?src-supplier=Digi-Key; Design Item ID: ABM8G-24.000MHZ-4Y-T3; Category: Crystals; ComponentLink3Description: https://datasheet.ciiva.com/854/abm8g-854912.pdf?src-supplier=Digi-Key; Stock 1: 4722; Source: LuxonisMaster.SchLib